# Altium schematic sheet MCU.SchDoc
size A3; SheetNumber: 1; SheetTotal: 3
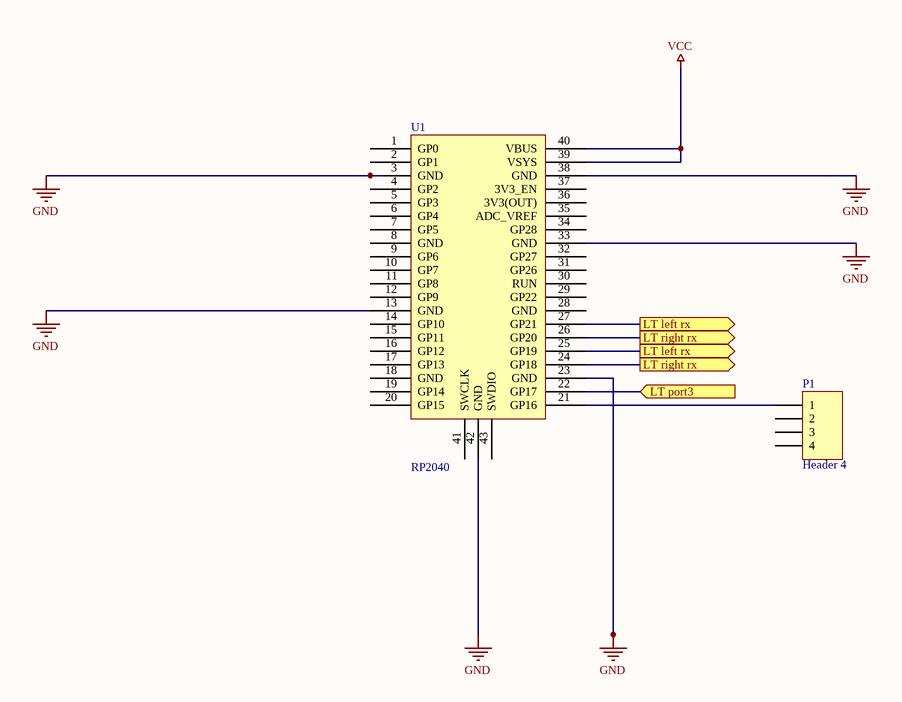
[diagram p0: MCU.SchDoc]

## Parts
P1  Header 4  [HDR1X4]
U1  RP2040  [PCBComponent_1]

## Ports
LT left rx (out), LT port3 (in), LT right rx (out)

## Nets
GND: U1.3(GND) U1.13(GND) U1.23(GND) U1.33(GND) U1.38(GND) U1.42(GND)
VCC: U1.39(VSYS) U1.40(VBUS)
LT left rx: U1.25(GP19) U1.27(GP21) ; port LT left rx
LT port3: U1.22(GP17) ; port LT port3
LT right rx: U1.24(GP18) U1.26(GP20) ; port LT right rx
NetP1_1: P1.1 U1.21(GP16)

Not connected (* = marked no-connect by the designer): P1 2 3 4; U1 1(GP0) 2(GP1) 4(GP2) 5(GP3) 6(GP4) 7(GP5) 8(GND) 9(GP6) 10(GP7) 11(GP8) 12(GP9) 14(GP10) 15(GP11) 16(GP12) 17(GP13) 18(GND) 19(GP14) 20(GP15) 28(GND) 29(GP22) 30(RUN) 31(GP26) 32(GP27) 34(GP28) 35(ADC_VREF) 36(3V3(OUT)) 37(3V3_EN) 41(SWCLK) 43(SWDIO)

## Library data of the parts
P1 = Header 4: Header, 4-Pin; LatestRevisionDate: 17-Jul-2002; LatestRevisionNote: Re-released for DXP Platform.; Publisher: Altium Limited
U1 = Component_1